# Altium schematic sheet JTAG.SchDoc
size A4
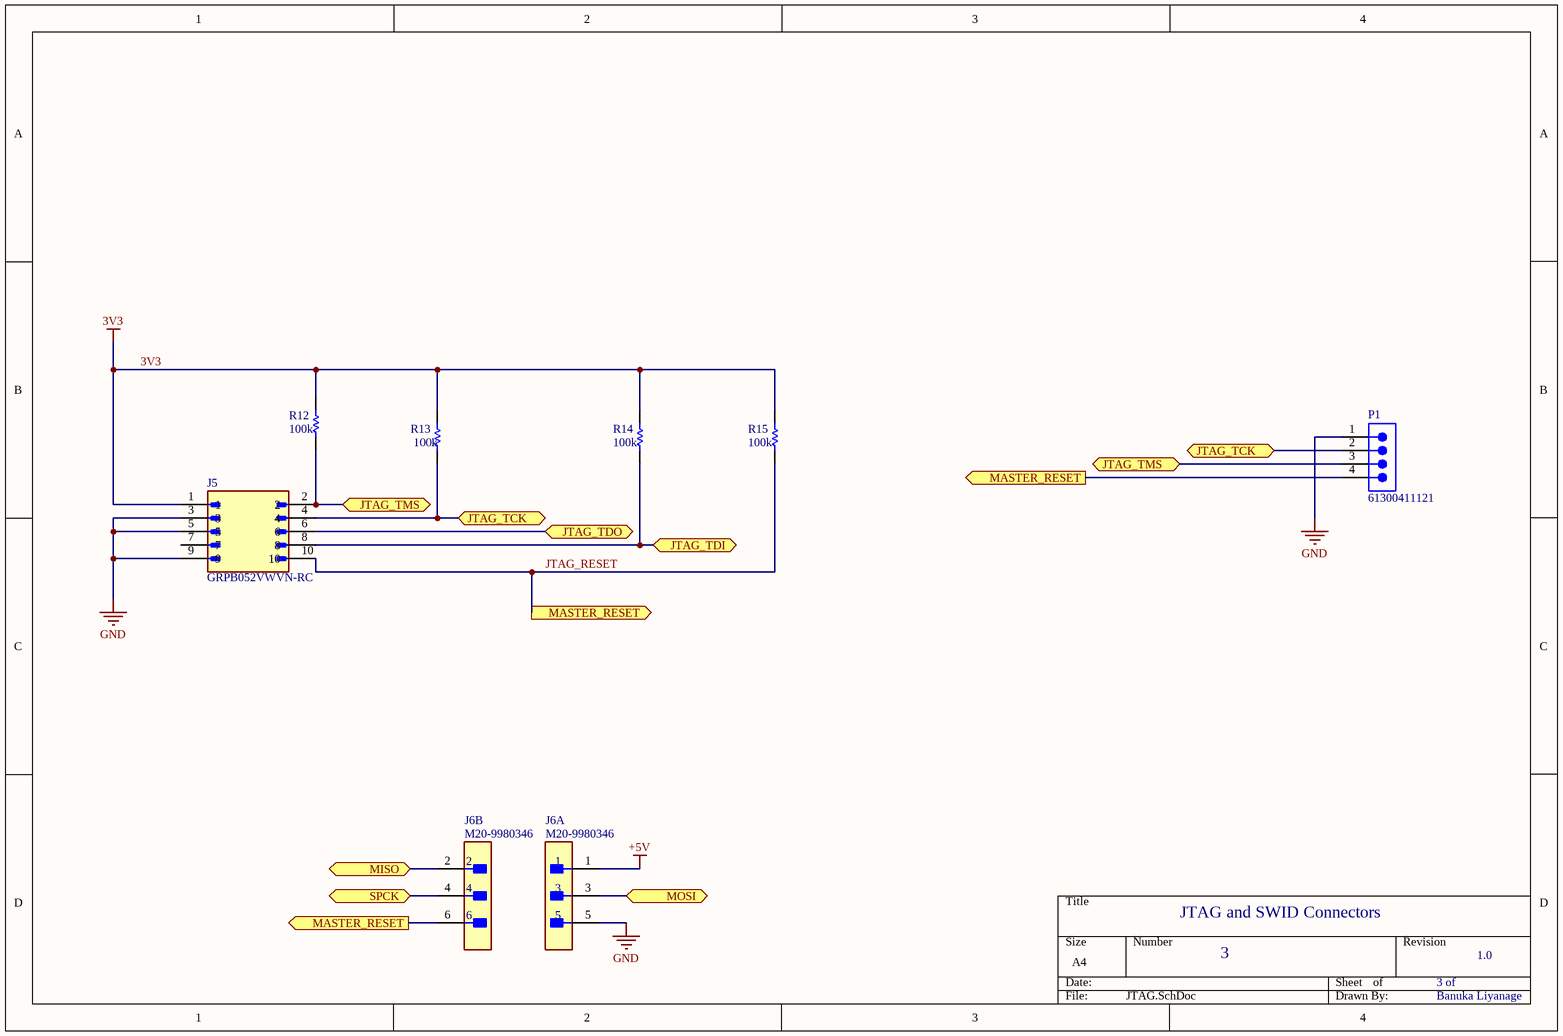
[diagram p0: JTAG.SchDoc]

## Parts
J5  GRPB052VWVN-RC  [SULLINS_GRPB052VWVN-RC]
J6  M20-9980346  [FP-M20-9980346-MFG]  (parts A,B of 2)
P1  61300411121  [61300411121]
R12  100k  [RESC2013X50X30ML20T20]
R13  100k  [RESC2013X50X30ML20T20]
R14  100k  [RESC2013X50X30ML20T20]
R15  100k  [RESC2013X50X30ML20T20]

## Ports
JTAG_TCK (bidir), JTAG_TDI (bidir), JTAG_TDO (bidir), JTAG_TMS (bidir), MASTER_RESET (out), MISO (bidir), MOSI (bidir), SPCK (bidir)

## Nets
3V3: J5.1 R12.2 R13.2 R14.2 R15.2
+5V: J6.1
GND: J5.3 J5.5 J5.9 J6.5 P1.1
JTAG_RESET: J5.10 J6.6 P1.4 R15.1 ; port MASTER_RESET
JTAG_TCK: J5.4 P1.2 R13.1 ; port JTAG_TCK
JTAG_TDI: J5.8 R14.1 ; port JTAG_TDI
JTAG_TDO: J5.6 ; port JTAG_TDO
JTAG_TMS: J5.2 P1.3 R12.1 ; port JTAG_TMS
MISO: J6.2 ; port MISO
MOSI: J6.3 ; port MOSI
SPCK: J6.4 ; port SPCK

Not connected (* = marked no-connect by the designer): J5 7

## Notes on the sheet
- JTAG and SWID Connectors
- 3
- 3 of
- 1.0
- Banuka Liyanage

## Library data of the parts
J5 = GRPB052VWVN-RC: Connector Header Through Hole 10 position 0.050 (1.27mm); MF: Sullins; Package: None; Price: None; Check_prices: https://www.snapeda.com/parts/GRPB052VWVN-RC/Sullins+Connector+Solutions/view-part/?ref=eda; Value: *; SnapEDA_Link: https://www.snapeda.com/parts/GRPB052VWVN-RC/Sullins+Connector+Solutions/view-part/?ref=snap; MP: GRPB052VWVN-RC; Availability: In Stock; Purchase-URL: https://pricing.snapeda.com/search/part/GRPB052VWVN-RC/?ref=eda
J6 = CMP-2000-06636-2: CONN HEADER VERT 6POS 2.54MM; Manufacturer: Harwin; Current Rating: 3A; Number Of Contacts: 6; Conn Gender: Male; Conn Orientation: Vertical; Device Class L1: Connectors; ComponentLink2Description: Datasheet; Height: 8.99mm; Temperature Range High: +105°C; Contact Material: Tin,Nickel; RoHS: TRUE; Temperature Range Low: -40°C; ComponentLink2URL: https://cdn.harwin.com/pdfs/M20-998.pdf; Digikey Description: CONN HEADER VERT 6POS 2.54MM; Pitch: 2.54mm; Package: M20-9980346; Device Class L2: Headers and Wire Housings; Manufacturer Part Number: M20-9980346; Number Of Rows: 2; Category: Conn; Lead Free: Yes; Mouser Description: 2.54mm (0.1") Pitch DIL Vertical PC Tail Pin Header, 6.1mm mating pin height, tin, 3+3 contacts; Temperature: -40°C to +105°C; Device Class L3: unset; Octopart: https://octopart.com/m20-9980346-harwin-5436545; Automotive: No
P1 = CMP-1502-01064-3: NexarPartId: 32855522; Operating Supply Voltage: 250V; Pitch: 2.54mm; Contact Resistance: 20mΩ; Number of Positions: 4; Current Rating: 3A; Connector Type: Male Pin; Gender: Male; Contact Plating: Gold; Height: 8.89mm; Lead Pitch: 2.54mm; Lead Free: Lead Free; Contact Mating Length: 5.9944mm; Number of Rows: 1; Termination: Solder; Packaging: Bulk; REACH SVHC: Unknown; Min Operating Temperature: -40°C; RoHS: Compliant; Number of Contacts: 4; Voltage Rating: 250V; Color: Black; Max Operating Temperature: 105°C; Contact Material: Copper; Mount: Through Hole; Orientation: Vertical; Number of Pins: 4
R12-R15 = CMP-2001-04900-1: Fixed Resistor, Metal Glaze/thick Film, 0.125W, 100000ohm, 150V, 5% +/-Tol, 200ppm/Cel, Surface Mount, 0805; Manufacturer: Vishay Dale; Part Number: CRCW0805100KJNEA